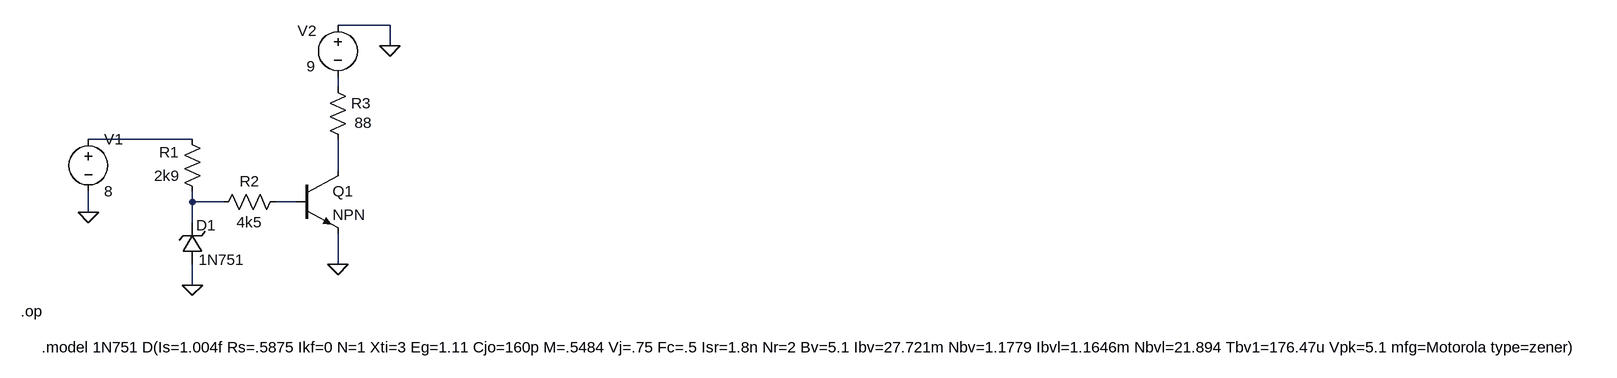
[diagram p0: schematic npn3.asc]
npn3.asc, the LTspice schematic file:
Version 4
SHEET 1 2428 680
WIRE 304 16 224 16
WIRE 304 48 304 16
WIRE 224 112 224 96
WIRE 0 192 -160 192
WIRE 224 240 224 192
WIRE 0 288 0 272
WIRE 48 288 0 288
WIRE 160 288 128 288
WIRE -160 304 -160 272
WIRE 0 320 0 288
WIRE 224 384 224 336
WIRE 0 416 0 384
FLAG 304 48 0
FLAG 224 384 0
FLAG 0 416 0
FLAG -160 304 0
SYMBOL res 16 288 R180
WINDOW 0 36 76 Left 2
WINDOW 3 36 40 Left 2
SYMATTR InstName R1
SYMATTR Value 2k9
SYMBOL res 144 272 R90
WINDOW 0 0 56 VBottom 2
WINDOW 3 32 56 VTop 2
SYMATTR InstName R2
SYMATTR Value 4k5
SYMBOL res 208 96 R0
WINDOW 3 42 70 Left 2
SYMATTR Value 88
SYMATTR InstName R3
SYMBOL npn 160 240 R0
SYMATTR InstName Q1
SYMBOL voltage -160 176 R0
WINDOW 123 0 0 Left 0
WINDOW 39 0 0 Left 0
SYMATTR InstName V1
SYMATTR Value 8
SYMBOL voltage 224 0 R0
WINDOW 0 -62 25 Left 2
WINDOW 3 -48 79 Left 2
WINDOW 123 0 0 Left 0
WINDOW 39 0 0 Left 0
SYMATTR InstName V2
SYMATTR Value 9
SYMBOL zener 16 384 R180
WINDOW 0 -21 60 Left 2
WINDOW 3 -65 7 Left 2
SYMATTR InstName D1
SYMATTR Value 1N751
TEXT -232 512 Left 2 !.model 1N751 D(Is=1.004f Rs=.5875 Ikf=0 N=1 Xti=3 Eg=1.11 Cjo=160p M=.5484 Vj=.75 Fc=.5 Isr=1.8n Nr=2 Bv=5.1 Ibv=27.721m Nbv=1.1779 Ibvl=1.1646m Nbvl=21.894 Tbv1=176.47u Vpk=5.1 mfg=Motorola type=zener)
TEXT -264 456 Left 2 !.op

The netlist it stands for:
* npn3.asc
R1 N004 N002 2k9
R2 N005 N004 4k5
R3 N001 N003 88
Q1 N003 N005 0 0 NPN
V1 N002 0 8
V2 0 N001 9
D1 0 N004 1N751
.model D D
.lib standard.dio
.model NPN NPN
.model PNP PNP
.lib standard.bjt
.model 1N751 D(Is=1.004f Rs=.5875 Ikf=0 N=1 Xti=3 Eg=1.11 Cjo=160p M=.5484 Vj=.75 Fc=.5 Isr=1.8n Nr=2 Bv=5.1 Ibv=27.721m Nbv=1.1779 Ibvl=1.1646m Nbvl=21.894 Tbv1=176.47u Vpk=5.1 mfg=Motorola type=zener)
.op
.backanno
.end